# EAGLE design mothership compact 0.42 (EAGLE 8.2.2)
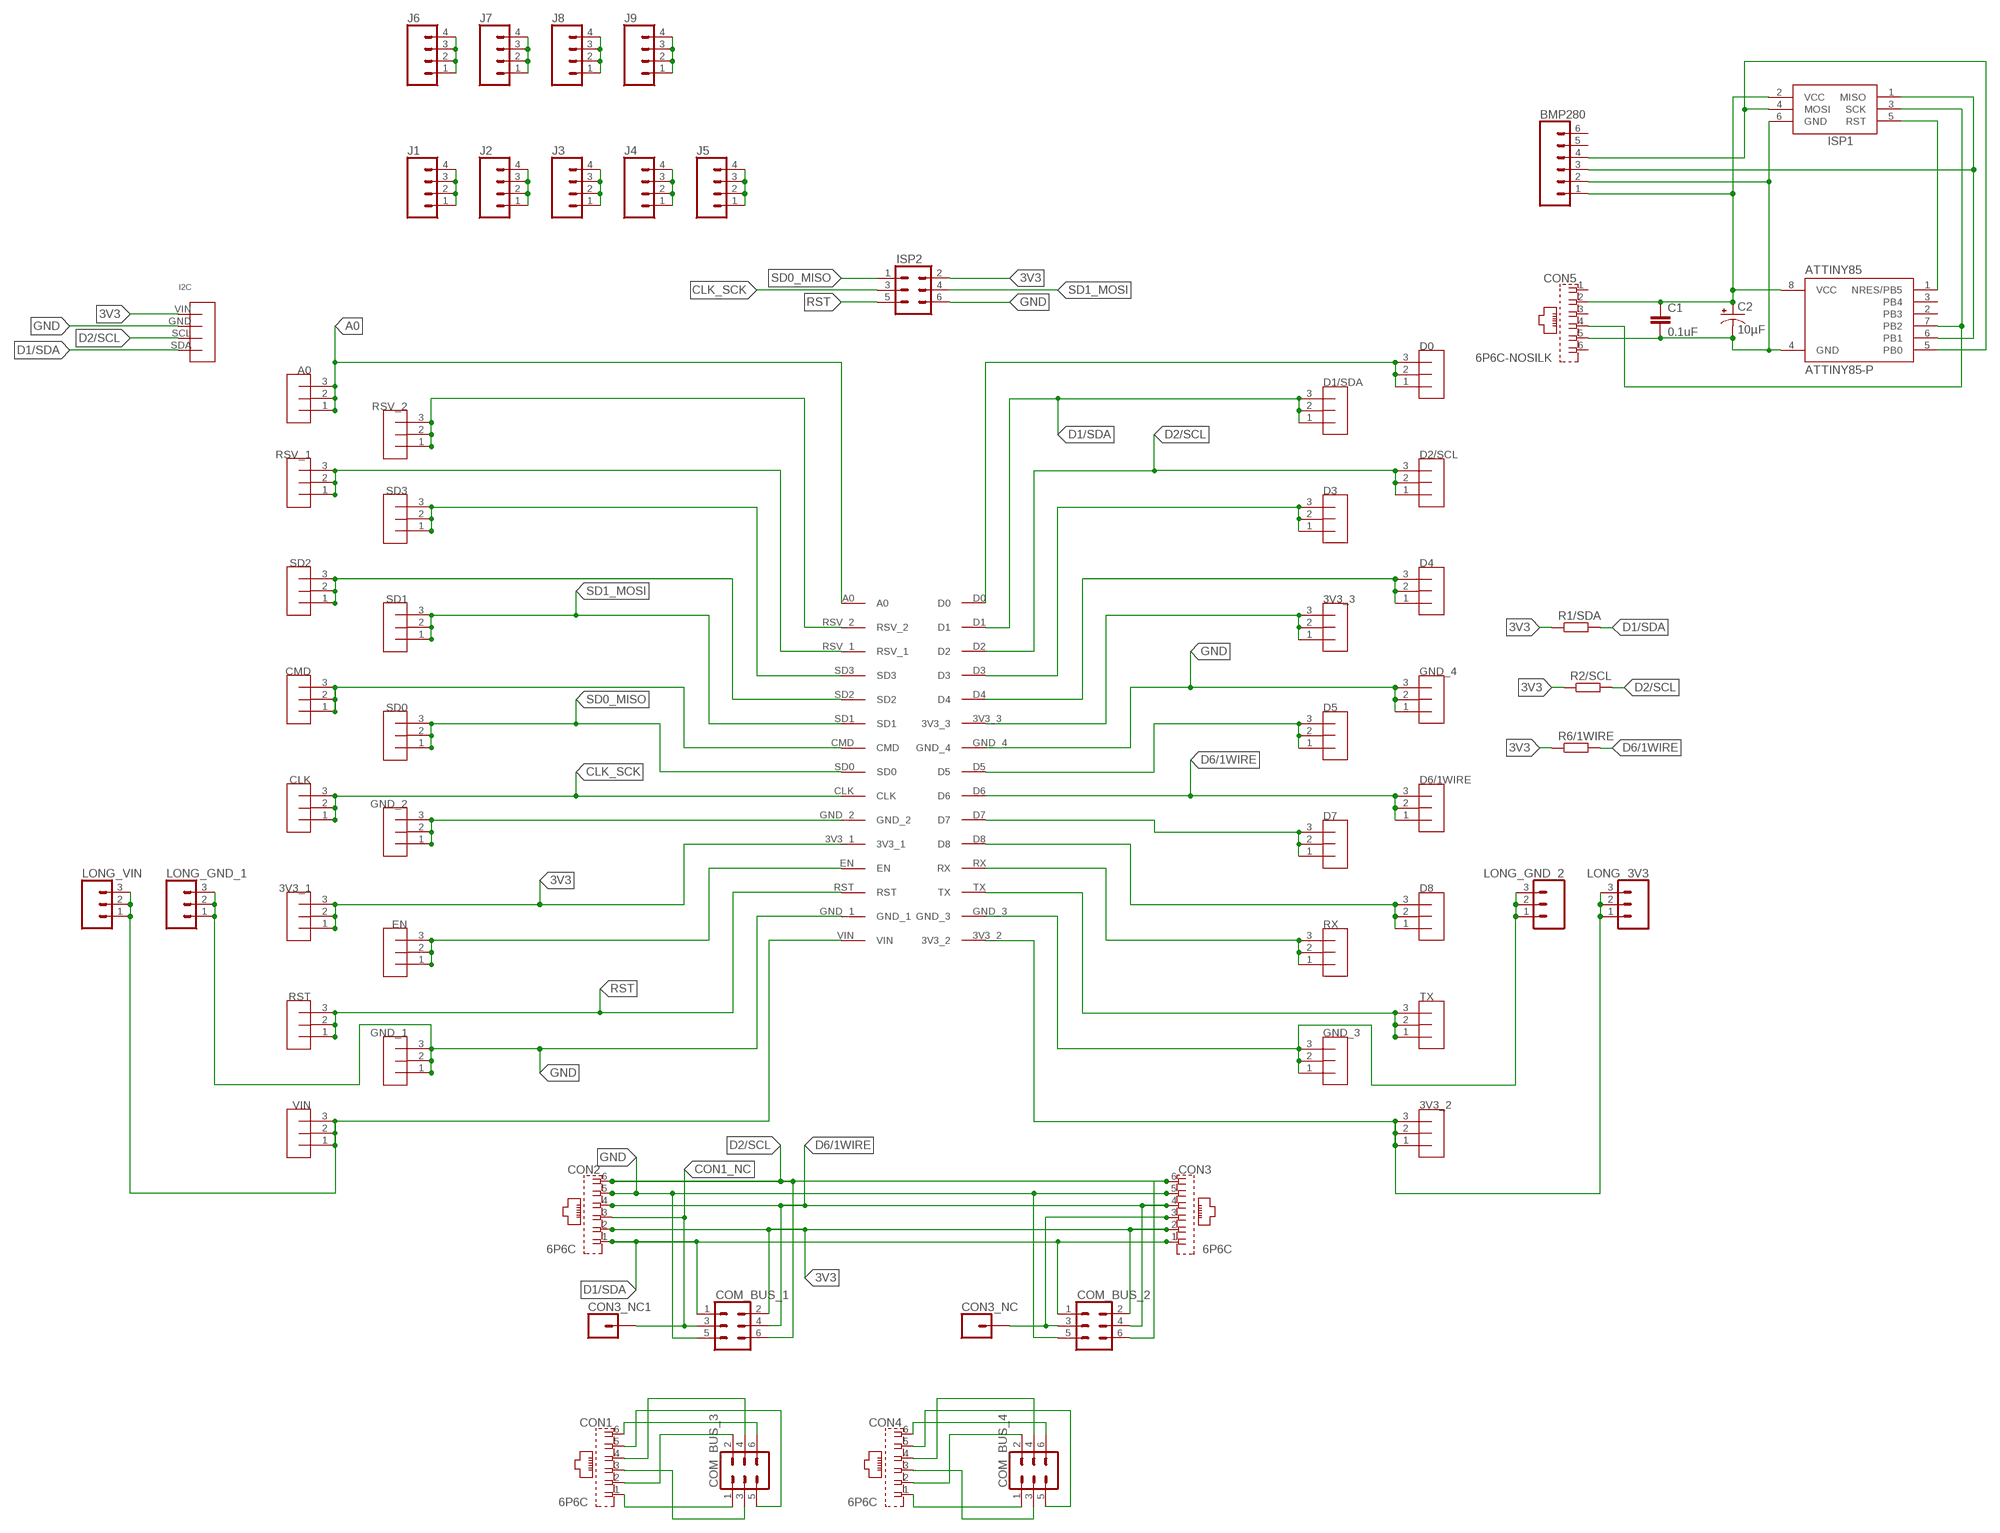
[diagram p0: schematic, sheet 1]

## Parts
3V3_1  JUMPERS  [3PIN]
3V3_2  JUMPERS  [3PIN]
3V3_3  JUMPERS  [3PIN]
A0  JUMPERS  [3PIN]
ATTINY85  ATTINY85-P  [PDIP08_300MIL]
BMP280  CONN_06NO_SILK_NO_POP  [1X06_NO_SILK]
C1  0.1uF  C-EU050-045X075  [C050-045X075]
C2  10µF  CPOL-USE2.5-5  [E2,5-5]
CLK  JUMPERS  [3PIN]
CMD  JUMPERS  [3PIN]
COM_BUS_1  CONN_03X2NO_SILK  [2X3-NS]
COM_BUS_2  CONN_03X2NO_SILK  [2X3-NS]
COM_BUS_3  CONN_03X2NO_SILK  [2X3-NS]
COM_BUS_4  CONN_03X2NO_SILK  [2X3-NS]
CON1  6P6C  [RJ11-6P6C-NOSHIELD]
CON2  6P6C  [RJ11-6P6C-NOSHIELD]
CON3  6P6C  [RJ11-6P6C-NOSHIELD]
CON3_NC  CONN_01PTH_NO_SILK_YES_STOP  [1X01_NO_SILK]
CON3_NC1  CONN_01PTH_NO_SILK_YES_STOP  [1X01_NO_SILK]
CON4  6P6C  [RJ11-6P6C-NOSHIELD]
CON5  6P6C-NOSILK  [RJ11-6P6C-NOSHIELD-NOSILK]
D0  JUMPERS  [3PIN]
D1/SDA  JUMPERS  [3PIN]
D2/SCL  JUMPERS  [3PIN]
D3  JUMPERS  [3PIN]
D4  JUMPERS  [3PIN]
D5  JUMPERS  [3PIN]
D6/1WIRE  JUMPERS  [3PIN]
D7  JUMPERS  [3PIN]
D8  JUMPERS  [3PIN]
EN  JUMPERS  [3PIN]
GND_1  JUMPERS  [3PIN]
GND_2  JUMPERS  [3PIN]
GND_3  JUMPERS  [3PIN]
GND_4  JUMPERS  [3PIN]
ISP1  AVRISP-6  [AVRISP]
ISP2  CONN_03X2NO_SILK  [2X3-NS]
J1  CONN_041X04_NO_SILK  [1X04_NO_SILK]
J2  CONN_041X04_NO_SILK  [1X04_NO_SILK]
J3  CONN_041X04_NO_SILK  [1X04_NO_SILK]
J4  CONN_041X04_NO_SILK  [1X04_NO_SILK]
J5  CONN_041X04_NO_SILK  [1X04_NO_SILK]
J6  CONN_041X04_NO_SILK  [1X04_NO_SILK]
J7  CONN_041X04_NO_SILK  [1X04_NO_SILK]
J8  CONN_041X04_NO_SILK  [1X04_NO_SILK]
J9  CONN_041X04_NO_SILK  [1X04_NO_SILK]
LONG_3V3  CONN_03  [1X03]
LONG_GND_1  CONN_03  [1X03]
LONG_GND_2  CONN_03  [1X03]
LONG_VIN  CONN_03  [1X03]
R1/SDA  R-EU_0207/10  [0207/10]
R2/SCL  R-EU_0207/10  [0207/10]
R6/1WIRE  R-EU_0207/10  [0207/10]
RST  JUMPERS  [3PIN]
RSV_1  JUMPERS  [3PIN]
RSV_2  JUMPERS  [3PIN]
RX  JUMPERS  [3PIN]
SD0  JUMPERS  [3PIN]
SD1  JUMPERS  [3PIN]
SD2  JUMPERS  [3PIN]
SD3  JUMPERS  [3PIN]
TX  JUMPERS  [3PIN]
U$1  NODEMCU  [NODEMCU]
U$2  I2CJUMPER  [4PIN,NAMED]
VIN  JUMPERS  [3PIN]

## Nets
3V3: 3V3_1.1 3V3_1.2 3V3_1.3 3V3_2.1 3V3_2.2 3V3_2.3 3V3_3.1 3V3_3.2 3V3_3.3 COM_BUS_1.2 COM_BUS_2.2 CON2.2 CON3.2 ISP2.2 LONG_3V3.1 LONG_3V3.2 LONG_3V3.3 R1/SDA.1 R2/SCL.1 R6/1WIRE.1 U$1.3V3_1 U$1.3V3_2 U$1.3V3_3 U$2.VIN
A0: A0.1 A0.2 A0.3 U$1.A0
ATT85_VCC: ATTINY85.8(VCC) BMP280.1 C1.1 C2.+ CON5.2 ISP1.2(VCC)
ATT_GND: ATTINY85.4(GND) BMP280.2 C1.2 C2.- CON5.5 ISP1.6(GND)
CLK_SCK: CLK.1 CLK.2 CLK.3 ISP2.3 U$1.CLK
CON1_NC: COM_BUS_1.3 CON2.3 CON3_NC1.1
CON3_NC: COM_BUS_2.3 CON3.3 CON3_NC.1
D1/SDA: COM_BUS_1.1 COM_BUS_2.1 CON2.1 CON3.1 D1/SDA.1 D1/SDA.2 D1/SDA.3 R1/SDA.2 U$1.D1 U$2.SDA
D2/SCL: COM_BUS_1.6 COM_BUS_2.6 CON2.6 CON3.6 D2/SCL.1 D2/SCL.2 D2/SCL.3 R2/SCL.2 U$1.D2 U$2.SCL
D6/1WIRE: COM_BUS_1.4 COM_BUS_2.4 CON2.4 CON3.4 D6/1WIRE.1 D6/1WIRE.2 D6/1WIRE.3 R6/1WIRE.2 U$1.D6
GND: COM_BUS_1.5 COM_BUS_2.5 CON2.5 CON3.5 GND_1.1 GND_1.2 GND_1.3 GND_2.1 GND_2.2 GND_2.3 GND_3.1 GND_3.2 GND_3.3 GND_4.1 GND_4.2 GND_4.3 ISP2.6 LONG_GND_1.1 LONG_GND_1.2 LONG_GND_1.3 LONG_GND_2.1 LONG_GND_2.2 LONG_GND_2.3 U$1.GND_1 U$1.GND_2 U$1.GND_3 U$1.GND_4 U$2.GND
N$1: EN.1 EN.2 EN.3 U$1.EN
N$2: D0.1 D0.2 D0.3 U$1.D0
N$3: SD3.1 SD3.2 SD3.3 U$1.SD3
N$4: J1.1 J1.2 J1.3 J1.4
N$5: RSV_1.1 RSV_1.2 RSV_1.3 U$1.RSV_1
N$6: SD2.1 SD2.2 SD2.3 U$1.SD2
N$7: RSV_2.1 RSV_2.2 RSV_2.3 U$1.RSV_2
N$8: CMD.1 CMD.2 CMD.3 U$1.CMD
N$9: J2.1 J2.2 J2.3 J2.4
N$10: J3.1 J3.2 J3.3 J3.4
N$11: J4.1 J4.2 J4.3 J4.4
N$12: J5.1 J5.2 J5.3 J5.4
N$13: J6.1 J6.2 J6.3 J6.4
N$14: J7.1 J7.2 J7.3 J7.4
N$15: J8.1 J8.2 J8.3 J8.4
N$17: J9.1 J9.2 J9.3 J9.4
N$18: D4.1 D4.2 D4.3 U$1.D4
N$19: COM_BUS_3.1 CON1.1
N$21: D8.1 D8.2 D8.3 U$1.D8
N$22: TX.1 TX.2 TX.3 U$1.TX
N$23: COM_BUS_3.6 CON1.6
N$24: COM_BUS_3.5 CON1.5
N$25: RX.1 RX.2 RX.3 U$1.RX
N$26: D7.1 D7.2 D7.3 U$1.D7
N$27: D5.1 D5.2 D5.3 U$1.D5
N$28: COM_BUS_3.4 CON1.4
N$29: D3.1 D3.2 D3.3 U$1.D3
N$30: COM_BUS_3.2 CON1.2
N$31: COM_BUS_3.3 CON1.3
N$32: COM_BUS_4.1 CON4.1
N$33: COM_BUS_4.6 CON4.6
N$34: COM_BUS_4.5 CON4.5
N$35: COM_BUS_4.4 CON4.4
N$36: COM_BUS_4.2 CON4.2
N$37: COM_BUS_4.3 CON4.3
PB0: ATTINY85.5(PB0) BMP280.4 ISP1.4(MOSI)
PB1: ATTINY85.6(PB1) BMP280.3 ISP1.1(MISO)
PB2: ATTINY85.7(PB2) CON5.4 ISP1.3(SCK)
PB5: ATTINY85.1(NRES/PB5) ISP1.5(RST)
RST: ISP2.5 RST.1 RST.2 RST.3 U$1.RST
SD0_MISO: ISP2.1 SD0.1 SD0.2 SD0.3 U$1.SD0
SD1_MOSI: ISP2.4 SD1.1 SD1.2 SD1.3 U$1.SD1
VIN: LONG_VIN.1 LONG_VIN.2 LONG_VIN.3 U$1.VIN VIN.1 VIN.2 VIN.3
Unconnected: ATTINY85.2(PB3) ATTINY85.3(PB4) BMP280.5 BMP280.6 CON5.1 CON5.3 CON5.6

## Library data of the parts
3V3_1-3V3_3 A0 CLK CMD D0 D1/SDA D2/SCL D3-D5 D6/1WIRE D7 D8 EN GND_1-GND_4 RST RSV_1 RSV_2 RX SD0 SD1-SD3 TX VIN = BrewBrain:JUMPERS
ATTINY85 = _hhn_attiny25_45_85:ATTINY85*: ATMEL ATtiny 85 Packages: P = PDIP 08 30mil S = SOIC 08 EIAJ 208mil Technologies Note: for complete ordering code (temp. range, finish, tape&reel etc.) see www.atmel.com • Supply Voltage: V = (1.8…5.5)V | [blank] = (2.7…5.5)V • Speed: 10 = 10 MHz | 20 = 20 MHz Author: Dipl.-Ing. FH Rainer Bayer HHN Hochschule Heilbronn (Heilbronn University), rainer.bayer@hs-heilbronn.de Ingenieurbüro ing-rb, mail@ing-rb.de
BMP280 = SparkFun-Connectors:CONN_06: Multi connection point. Often used as Generic Header-pin footprint for 0.1 inch spaced/style header connections On any of the 0.1 inch spaced packages, you can populate with these: Break Away Headers - Straight <https://www.sparkfun.com/products/116> (PRT-00116) Break Away Male Headers - Right Angle <https://www.sparkfun.com/products/553> (PRT-00553) Female Headers <https://www.sparkfun.com/products/115> (PRT-00115) Break Away Headers - Machine Pin <https://www.sparkfun.com/products/117> (PRT-00117) Break Away Female Headers - Swiss Machine Pin <https://www.sparkfun.com/products/743> (PRT-00743) Arduino Stackable Header - 6 Pin <https://www.sparkfun.com/products/9280> (PRT-09280) For SCREWTERMINALS and SPRING TERMINALS visit here: Screw Terimnals on SparkFun.com <https://www.sparkfun.com/search/results?term=Screw+Terminals> (5mm/3.5mm/2.54mm spacing) This device is also useful as a general connection point to wire up your design to another part of your project. Our various solder wires solder well into these plated through hole pads. Hook-Up Wire - Assortment (Stranded, 22 AWG) <https://www.sparkfun.com/products/11375> (PRT-11375) Hook-Up Wire - Assortment (Solid Core, 22 AWG) <https://www.sparkfun.com/products/11367> (PRT-11367) View the entire wire category on our website here <https://www.sparkfun.com/categories/141>
C1 = rcl:C-EU: CAPACITOR, European symbol
C2 = adafruit:CPOL-US: POLARIZED CAPACITOR, American symbol
COM_BUS_1-COM_BUS_4 ISP2 = SparkFun-Connectors:CONN_03X2: Multi connection point. Often used as Generic Header-pin footprint for 0.1 inch spaced/style header connections You can populate with any combo of single row headers, but if you'd like an exact match, check these: Header - 2x3 (Male, 0.1") <https://www.sparkfun.com/products/12807> (PRT-12807) Header - 2x3 (Female, 0.1") <https://www.sparkfun.com/products/13010> (PRT-13010) 2x3 Pin Shrouded Header <https://www.sparkfun.com/products/10877> (PRT-10877) On any of the 0.1 inch spaced packages, you can populate with these: Break Away Headers - Straight <https://www.sparkfun.com/products/116> (PRT-00116) Break Away Male Headers - Right Angle <https://www.sparkfun.com/products/553> (PRT-00553) Female Headers <https://www.sparkfun.com/products/115> (PRT-00115) Break Away Headers - Machine Pin <https://www.sparkfun.com/products/117> (PRT-00117) Break Away Female Headers - Swiss Machine Pin <https://www.sparkfun.com/products/743> (PRT-00743) Special note: the shrouded connector mates well with our 3x2 ribbon cables: Ribbon Crimp Connector - 6-pin (2x3, Female) <https://www.sparkfun.com/products/10651> (PRT-10651) Ribbon Cable - 6 wire (15ft) <https://www.sparkfun.com/products/10646> (PRT-10646)
CON1-CON4 = BrewBrain:6P6C: RJ11 6 connects Source: YH-55-10.pdf; OC_FARNELL: unknown; OC_NEWARK: unknown
CON3_NC CON3_NC1 = SparkFun-Connectors:CONN_01: Single connection point. Often used as Generic Header-pin footprint for 0.1 inch spaced/style header connections On any of the 0.1 inch spaced packages, you can populate with these: Break Away Headers - Straight <https://www.sparkfun.com/products/116> (PRT-00116) Break Away Male Headers - Right Angle <https://www.sparkfun.com/products/553> (PRT-00553) Female Headers <https://www.sparkfun.com/products/115> (PRT-00115) Break Away Headers - Machine Pin <https://www.sparkfun.com/products/117> (PRT-00117) Break Away Female Headers - Swiss Machine Pin <https://www.sparkfun.com/products/743> (PRT-00743) This device is also useful as a general connection point to wire up your design to another part of your project. Our various solder wires solder well into these plated through hole pads. Hook-Up Wire - Assortment (Stranded, 22 AWG) <https://www.sparkfun.com/products/11375> (PRT-11375) Hook-Up Wire - Assortment (Solid Core, 22 AWG) <https://www.sparkfun.com/products/11367> (PRT-11367) View the entire wire category on our website here <https://www.sparkfun.com/categories/141> Special notes: SMTSO-256-ET is a "flush mount" nut for a 4-40 screw. We mostly use this on specialty testbeds; it is a nice way to connect hardware to your PCB at an adjustable hieght. Also note, the SNAP packages are for using a snappable style connector. We sell a baggie of snaps and they are also used on two LilyPad designs: Snap Assortment - 30 pack (male and female) <https://www.sparkfun.com/products/11347> (DEV-11347) LilyPad Arduino SimpleSnap <https://www.sparkfun.com/products/10941> (DEV-10941) LilyPad SimpleSnap Protoboard <https://www.sparkfun.com/products/10940> (DEV-10940)
CON5 = BrewBrain:6P6C-NOSILK
ISP1 = adafruit:AVRISP: AVR ISP HEADER Standard 6 pin header for AVR programming
J1-J9 = SparkFun-Connectors:CONN_04: Multi connection point. Often used as Generic Header-pin footprint for 0.1 inch spaced/style header connections On any of the 0.1 inch spaced packages, you can populate with these: Break Away Headers - Straight <https://www.sparkfun.com/products/116> (PRT-00116) Break Away Male Headers - Right Angle <https://www.sparkfun.com/products/553> (PRT-00553) Female Headers <https://www.sparkfun.com/products/115> (PRT-00115) Break Away Headers - Machine Pin <https://www.sparkfun.com/products/117> (PRT-00117) Break Away Female Headers - Swiss Machine Pin <https://www.sparkfun.com/products/743> (PRT-00743) For SCREWTERMINALS and SPRING TERMINALS visit here: Screw Terimnals on SparkFun.com <https://www.sparkfun.com/search/results?term=Screw+Terminals> (5mm/3.5mm/2.54mm spacing) This device is also useful as a general connection point to wire up your design to another part of your project. Our various solder wires solder well into these plated through hole pads. Hook-Up Wire - Assortment (Stranded, 22 AWG) <https://www.sparkfun.com/products/11375> (PRT-11375) Hook-Up Wire - Assortment (Solid Core, 22 AWG) <https://www.sparkfun.com/products/11367> (PRT-11367) View the entire wire category on our website here <https://www.sparkfun.com/categories/141> Special notes: Molex polarized connector foot print use with SKU : PRT-08231 with associated crimp pins and housings. 1MM SMD Version SKU: PRT-10208; PROD_ID: CONN-09696
LONG_3V3 LONG_GND_1 LONG_GND_2 LONG_VIN = SparkFun-Connectors:CONN_03: Multi connection point. Often used as Generic Header-pin footprint for 0.1 inch spaced/style header connections On any of the 0.1 inch spaced packages, you can populate with these: Break Away Headers - Straight <https://www.sparkfun.com/products/116> (PRT-00116) Break Away Male Headers - Right Angle <https://www.sparkfun.com/products/553> (PRT-00553) Female Headers <https://www.sparkfun.com/products/115> (PRT-00115) Break Away Headers - Machine Pin <https://www.sparkfun.com/products/117> (PRT-00117) Break Away Female Headers - Swiss Machine Pin <https://www.sparkfun.com/products/743> (PRT-00743) Stackable Header - 3 Pin (Female, 0.1") <https://www.sparkfun.com/products/13875> (PRT-13875) For SCREWTERMINALS and SPRING TERMINALS visit here: Screw Terimnals on SparkFun.com <https://www.sparkfun.com/search/results?term=Screw+Terminals> (5mm/3.5mm/2.54mm spacing) This device is also useful as a general connection point to wire up your design to another part of your project. Our various solder wires solder well into these plated through hole pads. Hook-Up Wire - Assortment (Stranded, 22 AWG) <https://www.sparkfun.com/products/11375> (PRT-11375) Hook-Up Wire - Assortment (Solid Core, 22 AWG) <https://www.sparkfun.com/products/11367> (PRT-11367) View the entire wire category on our website here <https://www.sparkfun.com/categories/141> Special notes: Molex polarized connector foot print use with SKU : PRT-08232 with associated crimp pins and housings.
R1/SDA R2/SCL R6/1WIRE = resistor:R-EU_: RESISTOR, European symbol
U$1 = BrewBrain:NODEMCU
U$2 = BrewBrain:I2CJUMPER

## Net classes
0 default: clearance 0.205 mm

## Board
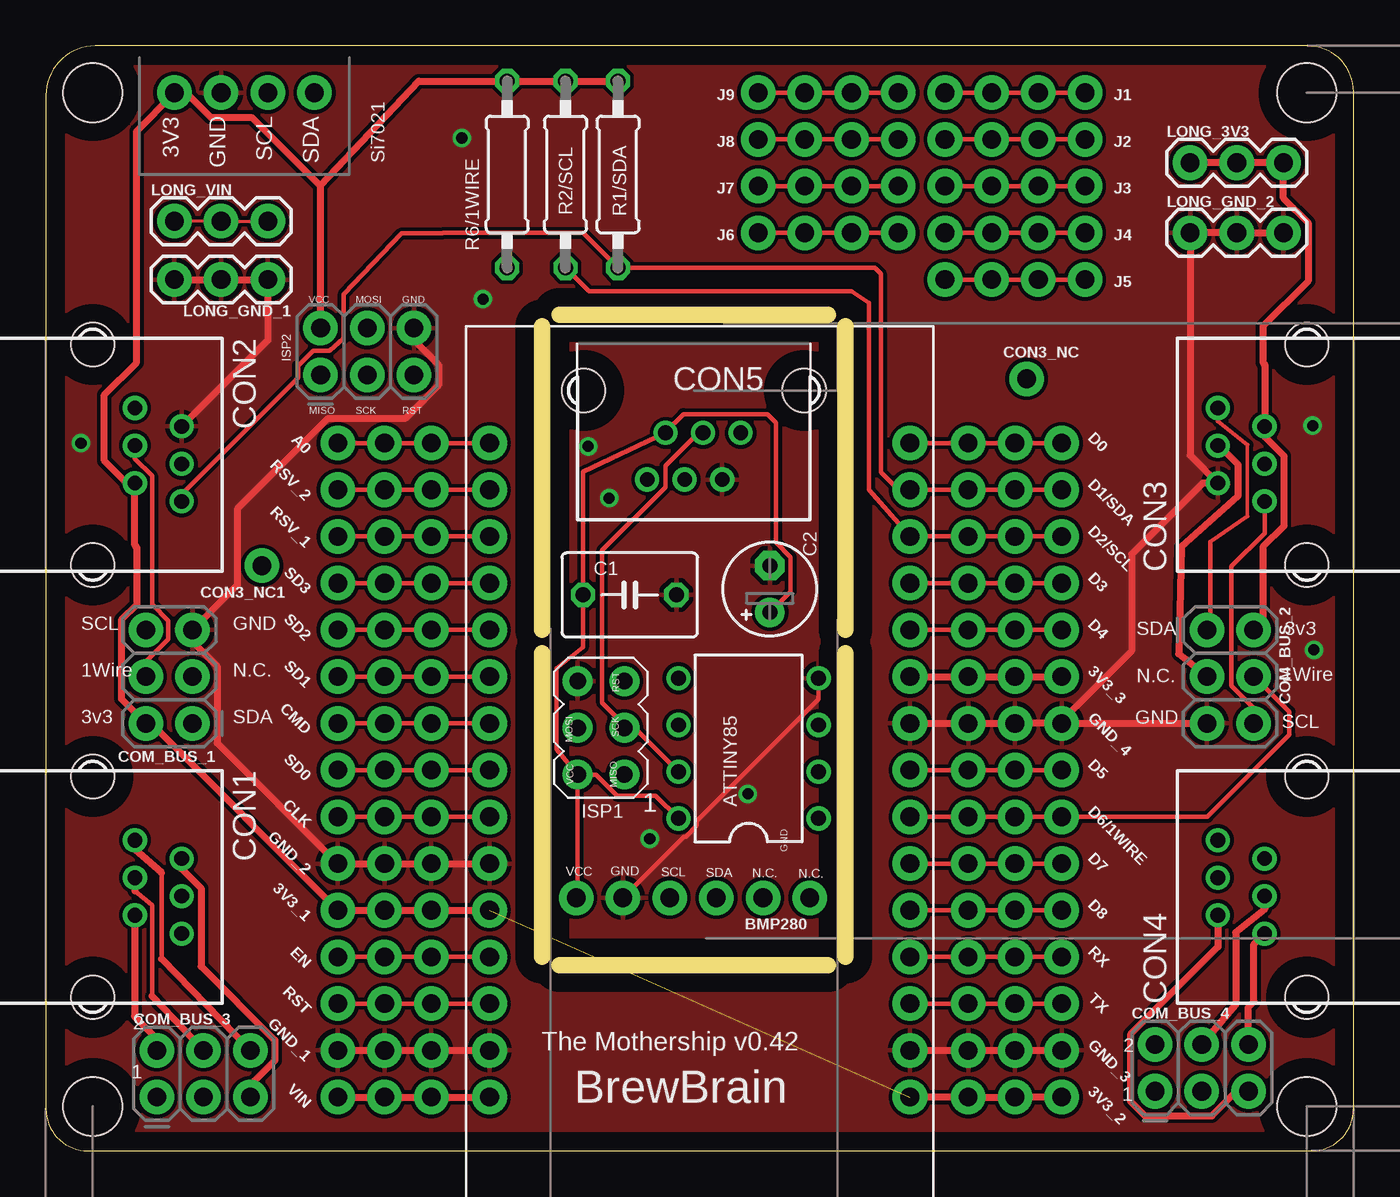
[diagram p1: board, top side]
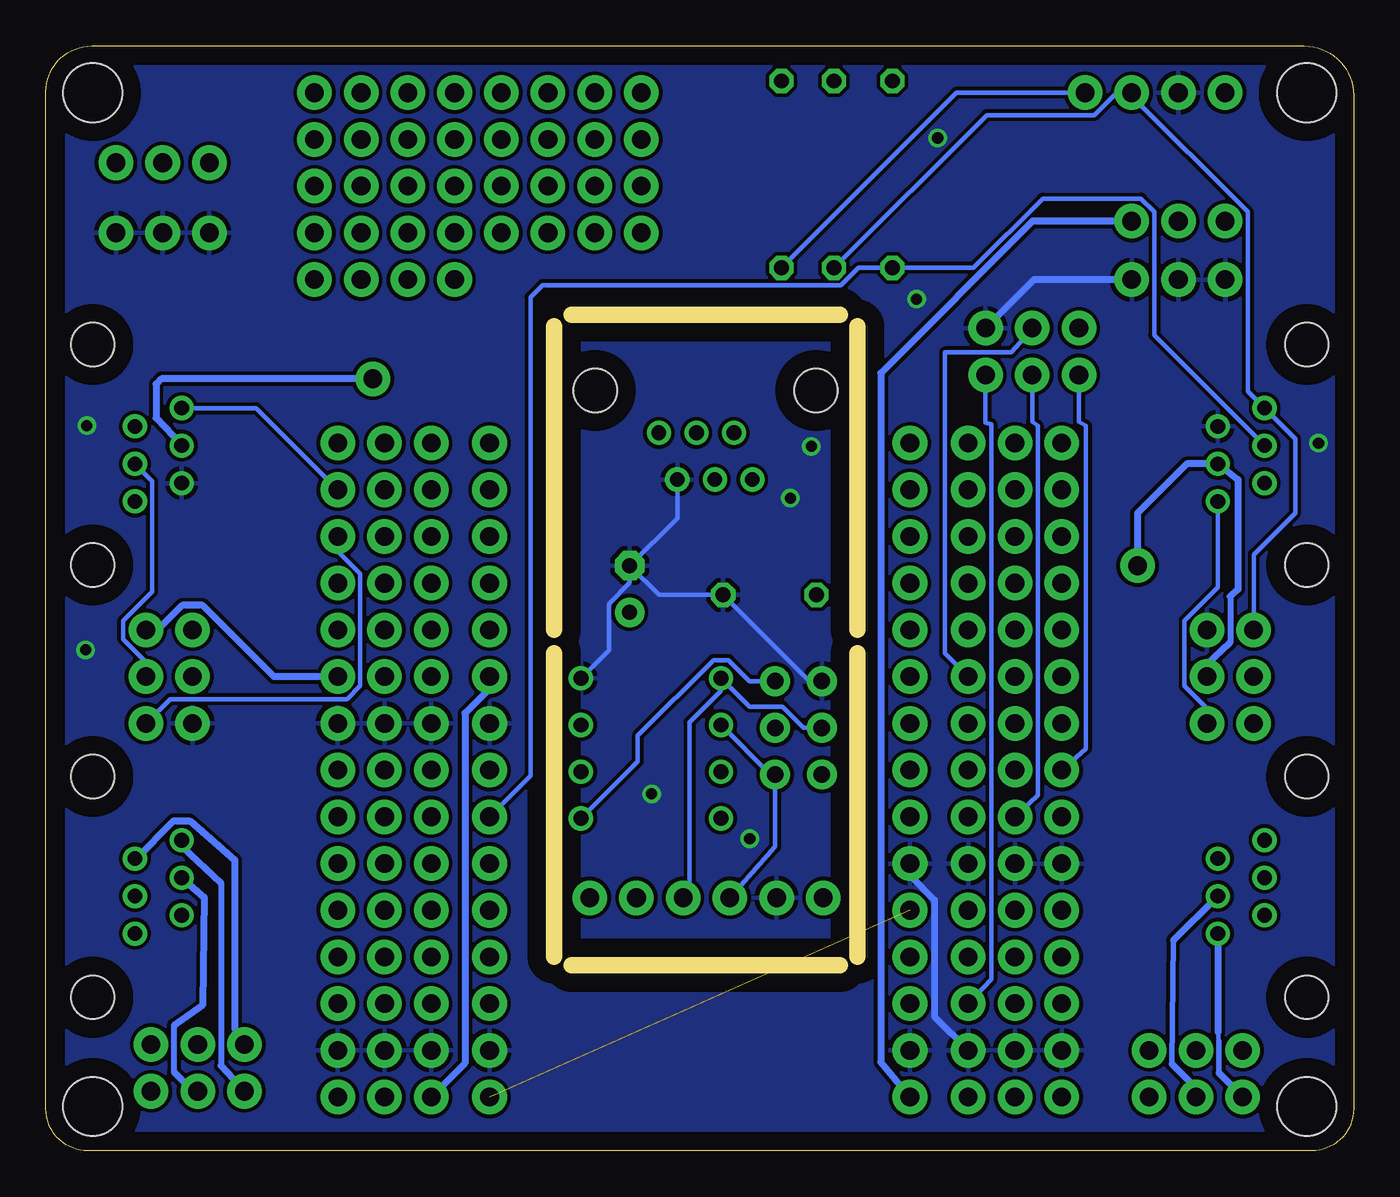
[diagram p2: board, bottom side, seen from below]

Size 71.12 x 60.07 mm. Coordinates in mm from the lower left corner, seen from the top.
Outline: 26.99,27.05 26.99,10.54
Outline: 26.99,44.83 26.99,28.32
Outline: 27.94,45.47 42.55,45.47
Outline: 43.5,44.83 43.5,28.32
Outline: 43.5,27.05 43.5,10.54
Outline: 27.94,10.08 42.55,10.08
Outline: 0,57.38 0,2.27 arc90 2.28,0 68.84,0 arc90 71.12,2.27 71.12,57.59 arc90 68.63,60.07 2.69,60.07 arc90 0,57.38
Copper layers (1*16): Top 0.035mm / dielectric 1.5mm / Bottom 0.035mm
Design rules "mothership": minimum track width 6mil, minimum drill 0.35mm, track to track 0.205mm, track to pad 0.205mm, pad to pad 0.205mm, via to via 0.205mm, smd to smd 6mil, copper to edge 40mil, drill to drill 6mil, minimum pad ring 10mil, minimum via ring 8mil, stop-mask expansion 4mil, vias tented up to drill 0mil, thermal gap 10mil
Holes 3.2 mm at 2.54,2.41 2.54,57.53 68.58,57.53 68.58,2.41

### Footprints (pad centres in the part's own frame; a part is rotated, then mirrored left to right if it is on the bottom)
3PIN = drill 1.016 pad 1.88: 1 0,0; 2 2.54,0; 3 5.08,0
PDIP08_300MIL = drill 0.813: 1 -3.81,-3.81; 2 -1.27,-3.81; 3 1.27,-3.81; 4 3.81,-3.81; 5 3.81,3.81; 6 1.27,3.81; 7 -1.27,3.81; 8 -3.81,3.81
1X06_NO_SILK = drill 1.016 pad 1.88: 1 0,0; 2 2.54,0; 3 5.08,0; 4 7.62,0; 5 10.16,0; 6 12.7,0
C050-045X075 = drill 0.813 octagon: 1 -2.54,0; 2 2.54,0
E2,5-5 = drill 0.813 pad 1.6: + -1.27,0 | drill 0.813 pad 1.6 octagon: - 1.27,0
2X3-NS = drill 1.016 pad 1.88: 1 -2.54,-1.27; 2 -2.54,1.27; 3 0,-1.27; 4 0,1.27; 5 2.54,-1.27; 6 2.54,1.27
RJ11-6P6C-NOSHIELD = drill 0.8 pad 1.3: 1 2.54,4.84; 2 1.54,2.3; 3 0.5,4.84; 4 -0.5,2.3; 5 -1.54,4.84; 6 -2.54,2.3 | hole 2.36: -6,0; 6,0
1X01_NO_SILK = drill 1.016 pad 1.88: 1 0,0
RJ11-6P6C-NOSHIELD-NOSILK = drill 0.8 pad 1.3: 1 2.54,4.84; 2 1.54,2.3; 3 0.5,4.84; 4 -0.5,2.3; 5 -1.54,4.84; 6 -2.54,2.3 | hole 2.36: -6,0; 6,0
AVRISP = drill 0.9 pad 1.626: 1 -1.27,2.54; 2 1.27,2.54; 3 -1.27,0; 4 1.27,0; 5 -1.27,-2.54; 6 1.27,-2.54
1X04_NO_SILK = drill 1.016 pad 1.88: 1 0,0; 2 2.54,0; 3 5.08,0; 4 7.62,0
1X03 = drill 1.016 pad 1.88: 1 0,0; 2 2.54,0; 3 5.08,0
0207/10 = drill 0.813 octagon: 1 -5.08,0; 2 5.08,0
NODEMCU = drill 1.016 pad 1.88: 3V3_1 -11.43,12.7; 3V3_2 11.43,2.54; 3V3_3 11.43,25.4; A0 -11.43,38.1; CLK -11.43,17.78; CMD -11.43,22.86; D0 11.43,38.1; D1 11.43,35.56; D2 11.43,33.02; D3 11.43,30.48; D4 11.43,27.94; D5 11.43,20.32; D6 11.43,17.78; D7 11.43,15.24; D8 11.43,12.7; EN -11.43,10.16; GND_1 -11.43,5.08; GND_2 -11.43,15.24; GND_3 11.43,5.08; GND_4 11.43,22.86; RST -11.43,7.62; RSV_1 -11.43,33.02; RSV_2 -11.43,35.56; RX 11.43,10.16; SD0 -11.43,20.32; SD1 -11.43,25.4; SD2 -11.43,27.94; SD3 -11.43,30.48; TX 11.43,7.62; VIN -11.43,2.54
4PIN,NAMED = drill 1.016 pad 1.88: GND 2.54,0; SCL 5.08,0; SDA 7.62,0; VIN 0,0

### Placement (x,y rotation side)
3V3_1  15.88,13.08 0 top
3V3_2  55.24,2.92 180 top
3V3_3  55.24,25.78 180 top
A0  15.88,38.48 0 top
ATTINY85  38.21,21.88 90 top
BMP280  28.84,13.75 0 top
C1  31.75,30.23 0 top
C2  39.37,30.54 90 top
CLK  15.88,18.16 0 top
CMD  15.88,23.24 0 top
COM_BUS_1  6.71,25.78 90 top
COM_BUS_2  64.41,25.78 270 top
COM_BUS_3  8.57,4.19 0 top
COM_BUS_4  62.87,4.51 0 top
CON1  2.54,14.35 270 top
CON2  2.54,37.85 270 top
CON3  68.58,37.85 90 top
CON3_NC  53.34,41.97 0 top
CON3_NC1  11.75,31.81 180 top
CON4  68.58,14.35 90 top
CON5  35.24,41.34 180 top
D0  55.24,38.48 180 top
D1/SDA  55.24,35.94 180 top
D2/SCL  55.24,33.4 180 top
D3  55.24,30.86 180 top
D4  55.24,28.32 180 top
D5  55.24,20.7 180 top
D6/1WIRE  55.24,18.16 180 top
D7  55.24,15.62 180 top
D8  55.24,13.08 180 top
EN  15.88,10.54 0 top
GND_1  15.88,5.46 0 top
GND_2  15.88,15.62 0 top
GND_3  55.24,5.46 180 top
GND_4  55.24,23.24 180 top
ISP1  30.19,23 180 top
ISP2  17.48,43.46 0 top
J1  56.51,57.53 180 top
J2  56.51,54.99 180 top
J3  56.51,52.45 180 top
J4  56.51,49.91 180 top
J5  56.51,47.37 180 top
J6  46.35,49.91 180 top
J7  46.35,52.45 180 top
J8  46.35,54.99 180 top
J9  46.35,57.53 180 top
LONG_3V3  62.23,53.72 0 top
LONG_GND_1  12.07,47.37 180 top
LONG_GND_2  62.23,49.91 0 top
LONG_VIN  6.98,50.55 0 top
R1/SDA  31.12,53.09 270 top
R2/SCL  28.26,53.09 270 top
R6/1WIRE  25.08,53.09 270 top
RST  15.88,8 0 top
RSV_1  15.88,33.4 0 top
RSV_2  15.88,35.94 0 top
RX  55.24,10.54 180 top
SD0  15.88,20.7 0 top
SD1  15.88,25.78 0 top
SD2  15.88,28.32 0 top
SD3  15.88,30.86 0 top
TX  55.24,8 180 top
U$1  35.56,0.38 0 top
U$2  6.98,57.53 0 top
VIN  15.88,2.92 0 top

### Tracks (layer width: path | path; a pad name or v marks a point on that pad's centre or on a via)
3V3  (1 unrouted)
  Top 0.152: U$2.VIN 6.98,57.49 6.98,56.9
  Top 0.381: U$1.3V3_1 3V3_1.3 3V3_1.2 3V3_1.1 5.71,23.24 COM_BUS_1.2 4.1,24.58 4.1,28.87 4.93,29.7 4.93,32.84 4.84,32.92 CON2.2 4.4,36.31 3.18,37.53 3.18,41.11 4.93,42.86 4.93,55.43 6.98,57.49 | U$1.3V3_2 3V3_2.3 3V3_2.2 3V3_2.1 | U$1.3V3_3 3V3_3.3 3V3_3.2 3V3_3.1 | COM_BUS_2.2 66.19,28.83 66.19,32.84 67.33,33.97 67.33,37.78 66.28,38.83 CON3.2 66.28,42.77 66.19,42.86 66.19,44.84 68.65,47.29 68.65,50.46 67.31,51.8 LONG_3V3.3 LONG_3V3.2 LONG_3V3.1 | U$2.VIN 7.64,57.53 8.97,56.2 11.18,56.2 14.9,52.48 | 14.9,52.48 14.92,52.45 14.92,44.74 ISP2.2 | 14.9,52.48 20.27,58.17 R6/1WIRE.1 R2/SCL.1 R1/SDA.1
  Bottom 0.381: U$1.3V3_3 46.99,25.13 48.33,23.79 48.33,4.76 3V3_2.3 | 3V3_3.1 58.72,25.78 62.59,29.66 63.7,29.66 65.03,28.32 COM_BUS_2.2
A0
  Top 0.254: U$1.A0 A0.3 18.5,38.48 A0.2 A0.1
ATT85_VCC
  Top 0.254: ISP1.2 27.77,21.83 27.77,26.24 29.21,27.38 C1.1 29.21,36.91 CON5.2 33.7,39.09 34.67,40.06 39.24,40.06 39.7,39.6 39.7,33.09 40.5,32.28 40.5,30.41 C2.+ | ISP1.2 28.92,14.59 BMP280.1 | ISP1.2 29.91,20.46 31.06,19.31 33.16,19.31 ATTINY85.8
ATT_GND  (via drill 0.6)
  Top 0.254: BMP280.2 34.71,17.08 34.81,17.08 35.4,17.66 35.4,17.93 42.02,24.56 ATTINY85.4
  Bottom 0.254: ISP1.6 29.6,25.54 C1.2 37.78,30.23 C2.- | CON5.5 36.78,34.4 C2.- | C2.- 39.37,30.88 40.5,29.74 40.5,27.21 ATTINY85.4
  other vias: 32.84,16.97 38.18,19.41 30.63,35.48 29.49,38.3
  pour Top: 27.58,44.78 27.74,10.64 42.9,10.64 42.82,12.01 42.82,44.63 42.98,44.78
  pour Bottom: 27.58,44.78 27.58,10.57 42.9,10.57 42.98,12.09 43.05,45.01 27.66,45.01
CLK_SCK
  Top 0.254: U$1.CLK CLK.3 CLK.2 CLK.1
  Bottom 0.254: ISP2.3 17.48,39.65 17.17,39.42 17.17,19.33 CLK.2
CON1_NC
  Bottom 0.33: 6.71,30.14 6.71,27.66
  Bottom 0.381: COM_BUS_1.3 7.98,26.44 6.71,27.66 | 6.71,30.14 6.29,30.52 6.29,36.49 CON2.3 9.07,37.35 11.75,34.67 CON3_NC1.1
CON3_NC
  Top 0.381: CON3.3 63.9,38.26 64.83,37.33 64.83,35.6 61.76,32.85 61.61,27.02 63.15,25.8 COM_BUS_2.3
  Bottom 0.381: CON3.3 63.74,38.38 65.13,39.85 65.13,41.69 64.85,41.97 CON3_NC.1
D1/SDA
  Top 0.152: 52.43,35.94 50.27,35.94 D1/SDA.3 U$1.D1
  Top 0.203: 65.35,34.5 65.35,38.38
  Top 0.254: 50.27,35.94 U$1.D1 46.35,35.94 45.4,36.89 45.4,47.69 45.09,48.01 R1/SDA.2 29.21,49.91 21.59,49.91 21.56,49.89 19.36,49.89 16.2,46.58 16.2,44.19 | D1/SDA.3 52.43,35.94 D1/SDA.2 D1/SDA.1 | 65.35,34.5 63.33,33.12 63.33,28.83 COM_BUS_2.1 | 65.35,38.38 63.74,39.67 CON3.1 | CON2.1 7.38,35.7 13.71,42.04 13.71,42.7 14.53,43.51 15.44,43.51 16.2,44.19 | 16.2,44.19 16.18,44.32
  Bottom 0.254: CON2.1 7.38,30.64 9.2,28.83 9.2,25.27 7.98,24.05 COM_BUS_1.1 | CON3.1 59.69,40.39 D1/SDA.1 | U$2.SDA 21.59,57.53 R1/SDA.2
D2/SCL
  Top 0.152: 50.45,33.4 52.5,33.4 D2/SCL.2 D2/SCL.1
  Top 0.254: D2/SCL.1 52.5,33.4 | D2/SCL.2 50.45,33.4 D2/SCL.3 U$1.D2 44.77,35.94 44.77,46.1 43.81,46.74 29.53,46.74 R2/SCL.2 | CON3.6 66.28,33.59 64.46,31.77 64.46,25.27 65.69,24.05 COM_BUS_2.6
  Bottom 0.254: COM_BUS_1.6 5.43,32.41 3.18,34.67 3.18,38.72 CON2.6 5.76,41.31 5.76,51.05 12.15,57.44 U$2.SCL 12.88,57.53 14.1,56.31 19.95,56.31 R2/SCL.2 | COM_BUS_2.6 64.37,24.56 54.74,24.56 54.02,25.27 54.02,31.37 55.24,32.59 D2/SCL.1
D6/1WIRE
  Top 0.254: U$1.D6 47.08,18.16 D6/1WIRE.3 50.19,18.16 D6/1WIRE.2 D6/1WIRE.1 59.69,18.16 59.79,18.16 63.18,18.16 67.63,22.61 67.63,23.88 65.72,25.78 COM_BUS_2.4 | CON2.4 4.84,37.63 5.77,36.69 5.77,29.71 6.66,28.83 6.66,27.81 5.43,26.59 COM_BUS_1.4
  Bottom 0.254: COM_BUS_2.4 65.69,26.59 66.91,27.81 66.91,28.83 65.34,30.39 65.34,36.41 CON3.4 | CON2.4 10.84,44.35 10.84,51.05 11.56,51.77 16.91,51.77 20.67,48.01 R6/1WIRE.2 26.93,48.01 27.87,47.06 44.12,47.06 44.77,46.42 44.77,20.38 U$1.D6
GND  (via drill 0.6)
  Top 0.152: GND_1.1 GND_1.2 20.83,5.46 GND_1.3 | GND_2.1 GND_2.2 18.5,15.62 20.83,15.62 GND_2.3 | GND_3.1 52.83,5.46 GND_3.2 50.44,5.46 GND_3.3 U$1.GND_3
  Top 0.381: COM_BUS_2.5 GND_4.1 55.11,23.24 | U$1.GND_4 GND_4.3 GND_4.2 55.11,23.24 | LONG_GND_2.3 LONG_GND_2.2 64.77,49.73 64.59,49.91 LONG_GND_2.1 62.23,37.82 CON3.5 62.91,36.31 59.05,32.45 59.05,27.19 55.11,23.24 | LONG_GND_1.3 LONG_GND_1.2 LONG_GND_1.1 12.07,44.07 CON2.5 | 18.5,15.62 GND_2.1 9.31,22.19 9.31,26.33 7.98,27.67 COM_BUS_1.5 10.41,30.76 10.41,34.91 15.32,39.82 19.53,39.82 21.35,41.64 21.35,42.74 20.02,44.08 ISP2.6 | GND_2.2 20.83,15.62 | GND_2.3 U$1.GND_2 | GND_1.1 GND_1.2 | GND_1.2 20.83,5.46 | GND_1.3 U$1.GND_1 | U$1.GND_3 50.44,5.46 | GND_3.3 52.83,5.46 | GND_3.2 GND_3.1
  Bottom 0.381: LONG_GND_1.1 17.37,47.37 ISP2.6 | U$1.GND_2 24.13,14.97 22.8,13.63 22.8,7.3 GND_1.3
  other vias: 1.91,38.48 68.9,39.43 68.96,27.24 22.62,55.07 23.77,46.3
  pour Top (isolate 0): 0.63,59.44 0.63,0.7 70.49,0.7 70.49,59.44
  pour Bottom (isolate 0): 0.63,59.44 0.63,0.7 70.49,0.7 70.49,59.44
N$1
  Top 0.152: EN.1 EN.2 18.59,10.54 EN.3 20.98,10.54 U$1.EN
  Top 0.254: EN.1 18.59,10.54 | EN.2 20.98,10.54 | EN.3 U$1.EN
N$2
  Top 0.152: 47.1,38.48 50.08,38.48 D0.3 D0.2
  Top 0.254: U$1.D0 47.1,38.48 D0.3 | D0.1 52.71,38.48 D0.2 50.08,38.48
N$3
  Top 0.254: SD3.1 18.3,30.86 SD3.2 SD3.3 U$1.SD3
N$4
  Top 0.254: J1.1 J1.2 J1.3 J1.4
N$5
  Top 0.254: U$1.RSV_1 20.97,33.4 RSV_1.3 RSV_1.2 RSV_1.1
N$6
  Top 0.254: U$1.SD2 20.97,28.32 SD2.3 SD2.2 SD2.1
N$7
  Top 0.254: RSV_2.1 RSV_2.2 20.91,35.94 RSV_2.3 U$1.RSV_2
N$8
  Top 0.152: CMD.1 18.18,23.24 CMD.2 CMD.3
  Top 0.254: U$1.CMD 20.97,23.24 CMD.3 18.18,23.24 | CMD.2 CMD.1
N$9
  Top 0.254: J2.4 J2.3 J2.2 J2.1
N$10
  Top 0.254: J3.1 J3.2 J3.3 J3.4
N$11
  Top 0.254: J4.4 J4.3 J4.2 J4.1
N$12
  Top 0.254: J5.1 J5.2 J5.3 J5.4
N$13
  Top 0.254: J6.4 J6.3 J6.2 J6.1
N$14
  Top 0.254: J7.1 J7.2 J7.3 J7.4
N$15
  Top 0.254: J8.4 J8.3 J8.2 J8.1
N$17
  Top 0.254: J9.1 J9.2 J9.3 J9.4
N$18
  Top 0.152: U$1.D4 D4.3 50.27,28.32 | 50.3,28.32 52.65,28.32 D4.2 D4.1
  Top 0.254: D4.1 52.65,28.32 | D4.2 50.3,28.32 50.27,28.32 U$1.D4
N$19
  Bottom 0.254: 7.38,6.45 7.32,5.97
  Bottom 0.305: 7.32,5.97 7.32,4.24
  Bottom 0.381: CON1.1 7.38,6.45 | 7.32,4.24 COM_BUS_3.1
N$21
  Top 0.152: 50.19,13.08 52.6,13.08 D8.2 D8.1
  Top 0.254: D8.1 52.6,13.08 | D8.2 50.19,13.08 D8.3 U$1.D8
N$22
  Top 0.254: TX.1 52.72,8 TX.2 50.31,8 TX.3 U$1.TX
N$23
  Top 0.254: 6.29,15.11 6.29,10.44
  Top 0.381: CON1.6 4.84,16.4 6.29,15.11 | 6.29,10.44 COM_BUS_3.6
N$24
  Top 0.381: CON1.5 7.38,15.33 8.43,14.29 8.43,10.03 12.45,6.01 12.45,4.91 11.11,3.57 COM_BUS_3.5
N$25
  Top 0.152: RX.2 50.24,10.54 RX.3 U$1.RX
  Top 0.254: U$1.RX 50.24,10.54 | RX.3 RX.2 RX.1
N$26
  Top 0.152: D7.1 52.83,15.62 D7.2 50.31,15.62 D7.3 U$1.D7
  Top 0.254: U$1.D7 50.31,15.62 | D7.3 52.83,15.62 | D7.2 D7.1
N$27
  Top 0.152: D5.1 52.83,20.7 D5.2 50.19,20.7 D5.3 U$1.D5
  Top 0.254: U$1.D5 50.19,20.7 | D5.3 52.83,20.7 | D5.2 D5.1
N$28
  Top 0.254: 4.84,14.13 5.77,13.36 5.77,8.42
  Top 0.381: CON1.4 4.84,14.13 | 5.77,8.42 COM_BUS_3.4
N$29
  Top 0.254: D3.1 55.13,30.86 D3.2 52.67,30.86 D3.3 50.01,30.86 U$1.D3
N$30
  Top 0.254: 4.77,7.36 4.8,7.33 4.84,7.37
  Top 0.381: COM_BUS_3.2 6.03,6.1 4.8,7.33 | CON1.2 4.84,7.37
N$31
  Bottom 0.305: 9.87,4.73 9.79,11.44
  Bottom 0.381: COM_BUS_3.3 8.65,3.51 9.87,4.73 | 9.79,11.44 CON1.3
N$32
  Bottom 0.254: CON4.1 63.74,16.55
  Bottom 0.33: 61.6,14.53 61.6,4.63
  Bottom 0.381: 61.6,4.63 COM_BUS_4.1 | 63.74,16.55 61.6,14.53
N$33
  Top 0.381: COM_BUS_4.6 65.41,7.81 65.7,8.11 65.7,11.23 CON4.6
N$34
  Top 0.381: CON4.5 63.74,11.08 58.99,6.33 58.99,2.68 59.77,1.9 63.42,1.9 64.75,3.24 COM_BUS_4.5
N$35
  Top 0.381: CON4.4 66.28,13.13 64.71,11.88 64.71,7.94 COM_BUS_4.4
N$36
  Bottom 0.254: CON4.2 66.22,15.89
  Bottom 0.381: COM_BUS_4.2 60.85,6.63 60.85,15.81 63.3,17.94 64.18,17.94 66.22,15.89
N$37
  Bottom 0.33: 64.13,4.28 64.13,6.82
  Bottom 0.381: COM_BUS_4.3 62.94,3.06 64.13,4.28 | 64.13,6.82 62.58,7.95 62.5,13.76 CON4.3
PB0
  Bottom 0.254: ISP1.4 29.91,23 31.06,24.14 32.86,24.14 ATTINY85.5 34.4,25.01 36.12,23.29 36.12,14.1 BMP280.4
PB1
  Bottom 0.254: ATTINY85.6 31.71,20.46 ISP1.1 31.46,16.52 BMP280.3
PB2
  Top 0.254: CON5.4 35.48,39.04 33.69,37.24 33.69,36.09 30.25,32.65 30.25,24.36 31.53,23.08 ISP1.3 32.02,23 ATTINY85.7
PB5
  Bottom 0.254: ATTINY85.1 38.94,21.16 38.94,22.56 34.81,26.68 33.99,26.68 32.85,25.54 ISP1.5
RST
  Top 0.152: U$1.RST RST.3 20.66,8 RST.2
  Top 0.254: U$1.RST 20.66,8 | RST.3 RST.2 RST.1
  Bottom 0.254: ISP2.5 20.02,39.57 19.71,39.51 19.71,9.33 RST.3
SD0_MISO
  Top 0.152: U$1.SD0 21.15,20.7 SD0.3 SD0.2
  Top 0.254: SD0.1 SD0.2 21.15,20.7 | SD0.3 U$1.SD0
  Bottom 0.254: ISP2.1 14.93,39.65 14.55,39.42 14.55,21.87 SD0.1
SD1_MOSI
  Top 0.254: SD1.1 SD1.2 SD1.3 U$1.SD1
  Bottom 0.254: ISP2.4 17.45,44.73 18.62,43.41 22.23,43.41 22.23,27.05 SD1.3
VIN
  Top 0.152: LONG_VIN.3 LONG_VIN.2 LONG_VIN.1 | U$1.VIN 21.09,2.92 VIN.3 18.5,2.92 VIN.2 VIN.1
  Top 0.381: VIN.1 18.5,2.92 | VIN.2 21.09,2.92 | VIN.3 U$1.VIN
  Bottom 0.381: U$1.VIN 25.72,4.83 25.72,42.29 17.46,50.55 LONG_VIN.3

### Text on the board
tPlace: Si7021 | VCC | MOSI | GND | ISP2 | MISO | SCK | RST | SCL | GND | SDA | 3v3 | 1Wire | N.C. | RST | N.C. | 1Wire | 3v3 | SDA | GND | SCL | MOSI | SCK | VCC | MISO | GND | VCC | GND | SCL | SDA | N.C. | N.C. | 2 | The Mothership v0.42 | 2 | 1 | BrewBrain | 1
tValues: 4k7